# Altium schematic sheet INEMOundergrad.SchDoc
size A4
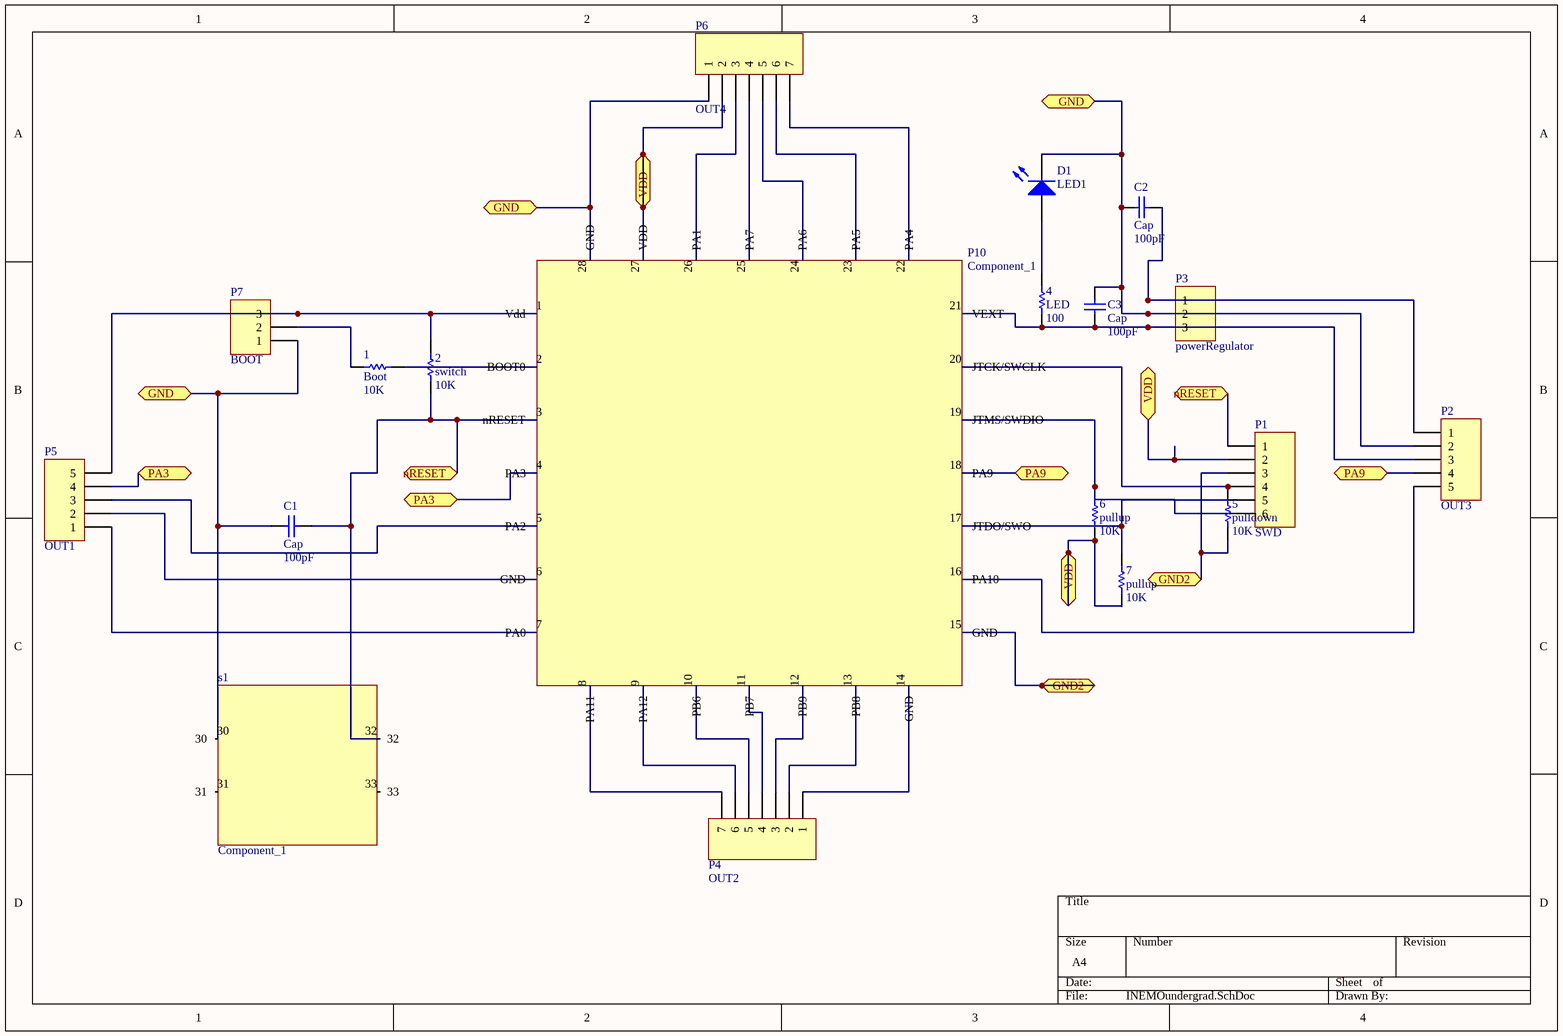
[diagram p0: INEMOundergrad.SchDoc]

## Parts
1  Boot  value 10K  [AXIAL-0.3]
2  switch  value 10K  [AXIAL-0.3]
4  LED  value 100  [AXIAL-0.3]
5  pulldown  value 10K  [AXIAL-0.3]
6  pullup  value 10K  [AXIAL-0.3]
7  pullup  value 10K  [AXIAL-0.3]
C1  Cap  value 100pF  [RAD-0.1]
C2  Cap  value 100pF  [RAD-0.1]
C3  Cap  value 100pF  [RAD-0.1]
D1  LED1  [LED-1]
P1  SWD  [HDR1X6]
P2  OUT3  [HDR1X5]
P3  powerRegulator  [HDR1X3]
P4  OUT2  [HDR1X7]
P5  OUT1  [HDR1X5]
P6  OUT4  [HDR1X7]
P7  BOOT  [HDR1X3]
P10  Component_1  [INEMO - duplicate3]
s1  Component_1  [swt]

## Ports
GND, GND2, nRESET, PA3, PA9, VDD

## Nets
GND: C1.1 C2.2 C3.2 D1.2(K) P2.2 P3.2 P6.1 P7.1 P10.28(GND) s1.30 ; port GND
GND2: 5.2 P1.3 P10.15(GND) ; port GND2
nRESET: 2.1 C1.2 P1.1 P10.3(nRESET) s1.32 ; port nRESET
PA3: P5.4 P10.4(PA3) ; port PA3
PA9: P2.4 P10.18(PA9) ; port PA9
VDD: 6.1 7.2 P1.2 P6.2 P10.27(VDD) ; port VDD
Net1_1: 1.1 P10.2(BOOT0)
Net1_2: 1.2 P7.2
Net2_2: 2.2 P5.5 P7.3 P10.1(Vdd)
Net4_1: 4.1 D1.1(A)
Net4_2: 4.2 C3.1 P2.3 P3.3 P10.21(VEXT)
Net5_1: 5.1 P1.4 P10.20(JTCK/SWCLK)
Net6_2: 6.2 7.1 P1.5 P1.6 P10.17(JTDO/SWO) P10.19(JTMS/SWDIO)
NetC2_1: C2.1 P2.1 P3.1
NetP2_5: P2.5 P10.16(PA10)
NetP4_1: P4.1 P10.14(GND)
NetP4_2: P4.2 P10.13(PB8)
NetP4_3: P4.3 P10.12(PB9)
NetP4_4: P4.4 P10.11(PB7)
NetP4_5: P4.5 P10.10(PB6)
NetP4_6: P4.6 P10.9(PA12)
NetP4_7: P4.7 P10.8(PA11)
NetP5_1: P5.1 P10.7(PA0)
NetP5_2: P5.2 P10.6(GND)
NetP5_3: P5.3 P10.5(PA2)
NetP6_3: P6.3 P10.26(PA1)
NetP6_4: P6.4 P10.25(PA7)
NetP6_5: P6.5 P10.24(PA6)
NetP6_6: P6.6 P10.23(PA5)
NetP6_7: P6.7 P10.22(PA4)

Not connected (* = marked no-connect by the designer): s1 31 33

## Library data of the parts
1 2 4-7 = Res1: Resistor; Published: 8-Jun-2000; LatestRevisionDate: 17-Jul-2002; LatestRevisionNote: Re-released for DXP Platform.; PackageReference: AXIAL-0.3; Publisher: Altium Limited; PackageDescription: Axial Device, Thru-Hole; 2 Leads; 0.3 in Pin Spacing
C1-C3 = Cap: Capacitor; Published: 8-Jun-2000; LatestRevisionDate: 17-Jul-2002; LatestRevisionNote: Re-released for DXP Platform.; PackageReference: RAD-0.3; Publisher: Altium Limited; PackageDescription: Radial Cap, Thru-Hole; 2 Leads; 0.3 in Pin Spacing
D1 = LED1: Typical RED GaAs LED; Published: 8-Jun-2000; LatestRevisionDate: 08-Jul-2005; LatestRevisionNote: Mech Layer 1 removed.; PackageReference: LED-1; Publisher: Altium Limited; PackageDescription: LED; 2 Leads
P1 = Header 6: Header, 6-Pin; LatestRevisionDate: 17-Jul-2002; LatestRevisionNote: Re-released for DXP Platform.; Publisher: Altium Limited
P2 P5 = Header 5: Header, 5-Pin; LatestRevisionDate: 17-Jul-2002; LatestRevisionNote: Re-released for DXP Platform.; Publisher: Altium Limited
P3 P7 = Header 3: Header, 3-Pin; LatestRevisionDate: 17-Jul-2002; LatestRevisionNote: Re-released for DXP Platform.; Publisher: Altium Limited
P4 P6 = Header 7: Header, 7-Pin; LatestRevisionDate: 17-Jul-2002; LatestRevisionNote: Re-released for DXP Platform.; Publisher: Altium Limited
s1 = Component_1: pin to pad: 30>1 31>2 32>4 33>3